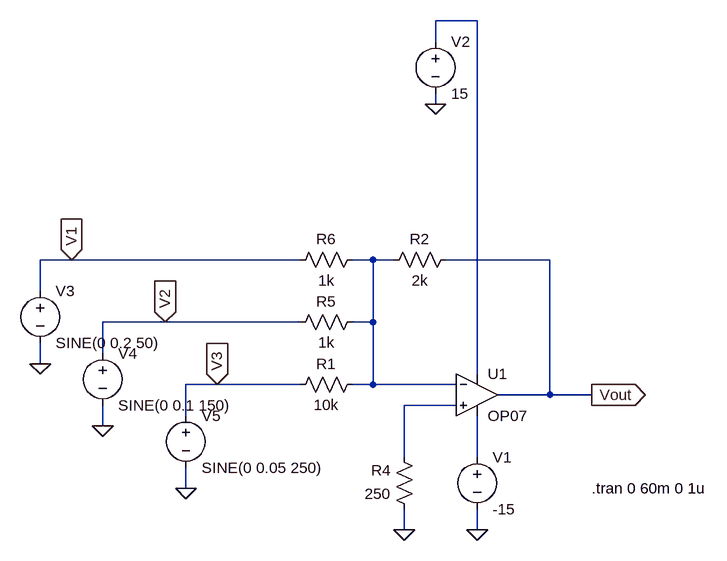
[diagram p0: schematic 005-Inverting-Summing-Amplifier.asc]
005-Inverting-Summing-Amplifier.asc, the LTspice schematic file:
Version 4
SHEET 1 880 680
WIRE 304 -464 240 -464
WIRE 240 -432 240 -464
WIRE 240 -336 240 -352
WIRE -320 -96 -368 -96
WIRE 32 -96 -320 -96
WIRE 144 -96 112 -96
WIRE 176 -96 144 -96
WIRE 416 -96 256 -96
WIRE -368 -48 -368 -96
WIRE -176 0 -272 0
WIRE 32 0 -176 0
WIRE 144 0 144 -96
WIRE 144 0 112 0
WIRE -272 48 -272 0
WIRE -368 64 -368 32
WIRE 304 80 304 -464
WIRE -96 96 -144 96
WIRE 32 96 -96 96
WIRE 144 96 144 0
WIRE 144 96 112 96
WIRE 272 96 144 96
WIRE 416 112 416 -96
WIRE 416 112 336 112
WIRE 480 112 416 112
WIRE 272 128 192 128
WIRE -144 144 -144 96
WIRE -272 160 -272 128
WIRE 192 208 192 128
WIRE 304 208 304 144
WIRE -144 256 -144 224
WIRE 192 320 192 288
WIRE 304 320 304 288
FLAG 304 320 0
FLAG 240 -336 0
FLAG -320 -96 V1
IOPIN -320 -96 In
FLAG 480 112 Vout
IOPIN 480 112 Out
FLAG -368 64 0
FLAG 192 320 0
FLAG -176 0 V2
IOPIN -176 0 In
FLAG -272 160 0
FLAG -96 96 V3
IOPIN -96 96 In
FLAG -144 256 0
SYMBOL voltage 304 192 R0
SYMATTR InstName V1
SYMATTR Value -15
SYMBOL voltage 240 -448 R0
SYMATTR InstName V2
SYMATTR Value 15
SYMBOL res 128 80 R90
WINDOW 0 0 56 VBottom 2
WINDOW 3 32 56 VTop 2
SYMATTR InstName R1
SYMATTR Value 10k
SYMBOL res 272 -112 R90
WINDOW 0 0 56 VBottom 2
WINDOW 3 32 56 VTop 2
SYMATTR InstName R2
SYMATTR Value 2k
SYMBOL voltage -368 -64 R0
WINDOW 123 0 0 Left 2
WINDOW 39 0 0 Left 2
SYMATTR InstName V3
SYMATTR Value SINE(0 0.2 50)
SYMBOL res 208 304 R180
WINDOW 0 36 76 Left 2
WINDOW 3 36 40 Left 2
SYMATTR InstName R4
SYMATTR Value 250
SYMBOL Opamps\\OP07 304 48 R0
SYMATTR InstName U1
SYMBOL res 128 -16 R90
WINDOW 0 0 56 VBottom 2
WINDOW 3 32 56 VTop 2
SYMATTR InstName R5
SYMATTR Value 1k
SYMBOL res 128 -112 R90
WINDOW 0 0 56 VBottom 2
WINDOW 3 32 56 VTop 2
SYMATTR InstName R6
SYMATTR Value 1k
SYMBOL voltage -272 32 R0
WINDOW 123 0 0 Left 2
WINDOW 39 0 0 Left 2
SYMATTR InstName V4
SYMATTR Value SINE(0 0.1 150)
SYMBOL voltage -144 128 R0
WINDOW 123 0 0 Left 2
WINDOW 39 0 0 Left 2
SYMATTR InstName V5
SYMATTR Value SINE(0 0.05 250)
TEXT 480 256 Left 2 !.tran 0 60m 0 1u

The netlist it stands for:
* 005-Inverting-Summing-Amplifier.asc
V1 N004 0 -15
V2 N001 0 15
R1 N002 V3 10k
R2 Vout N002 2k
V3 V1 0 SINE(0 0.2 50)
R4 0 N003 250
XU1 N003 N002 N001 N004 Vout LT1001  ; OP07, pins In+ In- V+ V- OUT
R5 N002 V2 1k
R6 N002 V1 1k
V4 V2 0 SINE(0 0.1 150)
V5 V3 0 SINE(0 0.05 250)
.tran 0 60m 0 1u
.lib LTC.lib
.backanno
.end